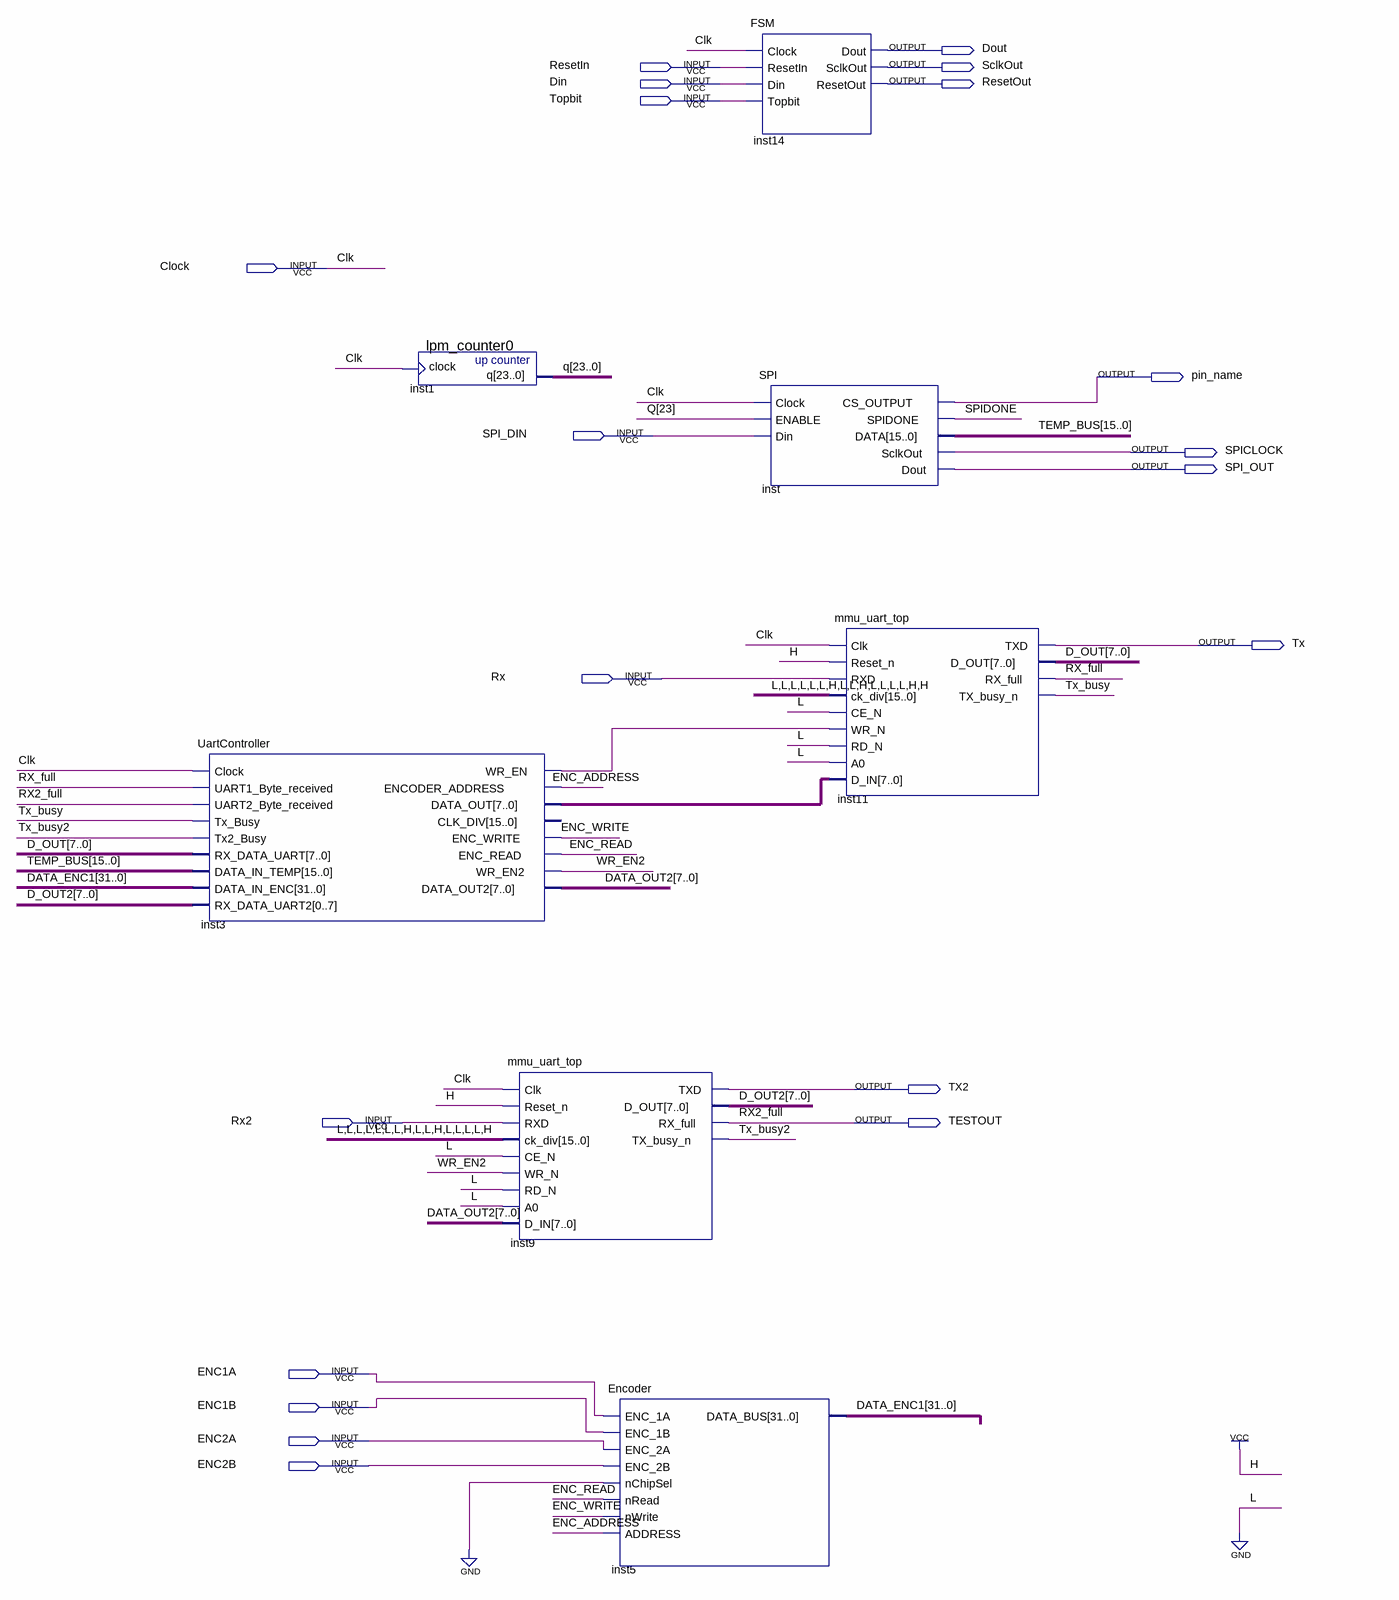
[diagram p0: schematic sheet]
// Quartus schematic test.bdf as structural Verilog: 7 symbols, 20 pins
module test (
  input  ResetIn,
  input  Din,
  input  Topbit,
  input  Clock,
  input  SPI_DIN,
  input  Rx,
  input  Rx2,
  input  ENC1A,
  input  ENC1B,
  input  ENC2A,
  input  ENC2B,
  output Dout,
  output SclkOut,
  output ResetOut,
  output pin_name,
  output SPICLOCK,
  output SPI_OUT,
  output Tx,
  output TX2,
  output TESTOUT
);

  wire ENC_ADDRESS, ENC_READ, ENC_WRITE, inst3_wr_en, RX_full, SPIDONE, Tx_busy, Tx_busy2, WR_EN2;
  wire [7:0] D_OUT, D_OUT2, DATA_OUT2, inst3_data_out;
  wire [15:0] TEMP_BUS;
  wire [23:0] q;
  wire [31:0] DATA_ENC1;

  UartController inst3 (
    .Clock(Clock), .UART1_Byte_received(RX_full), .UART2_Byte_received(TESTOUT), .Tx_Busy(Tx_busy),
    .Tx2_Busy(Tx_busy2), .RX_DATA_UART(D_OUT), .DATA_IN_TEMP(TEMP_BUS), .DATA_IN_ENC(DATA_ENC1),
    .RX_DATA_UART2(D_OUT2), .WR_EN(inst3_wr_en), .ENCODER_ADDRESS(ENC_ADDRESS), .DATA_OUT(inst3_data_out),
    .ENC_WRITE(ENC_WRITE), .ENC_READ(ENC_READ), .WR_EN2(WR_EN2), .DATA_OUT2(DATA_OUT2));  // open: CLK_DIV
  lpm_counter0 inst1 (.clock(Clock), .q(q));
  mmu_uart_top inst9 (
    .Clk(Clock), .Reset_n(1'b1), .RXD(Rx2), .ck_div(16'b0000000100100001), .CE_N(1'b0), .WR_N(WR_EN2),
    .RD_N(1'b0), .A0(1'b0), .D_IN(DATA_OUT2), .TXD(TX2), .D_OUT(D_OUT2), .RX_full(TESTOUT),
    .TX_busy_n(Tx_busy2));
  Encoder inst5 (
    .ENC_1A(ENC1A), .ENC_1B(ENC1B), .ENC_2A(ENC2A), .ENC_2B(ENC2B), .nChipSel(1'b0), .nRead(ENC_READ),
    .nWrite(ENC_WRITE), .ADDRESS(ENC_ADDRESS), .DATA_BUS(DATA_ENC1));
  FSM inst14 (
    .Clock(Clock), .ResetIn(ResetIn), .Din(Din), .Topbit(Topbit), .Dout(Dout), .SclkOut(SclkOut),
    .ResetOut(ResetOut));
  SPI inst (
    .Clock(Clock), .ENABLE(q[23]), .Din(SPI_DIN), .CS_OUTPUT(pin_name), .SPIDONE(SPIDONE), .DATA(TEMP_BUS),
    .SclkOut(SPICLOCK), .Dout(SPI_OUT));
  mmu_uart_top inst11 (
    .Clk(Clock), .Reset_n(1'b1), .RXD(Rx), .ck_div(16'b0000001001000011), .CE_N(1'b0), .WR_N(inst3_wr_en),
    .RD_N(1'b0), .A0(1'b0), .D_IN(inst3_data_out), .TXD(Tx), .D_OUT(D_OUT), .RX_full(RX_full),
    .TX_busy_n(Tx_busy));

  // Other names for the same wires on the sheet: Clk = Clock; RX2_full = TESTOUT
endmodule
